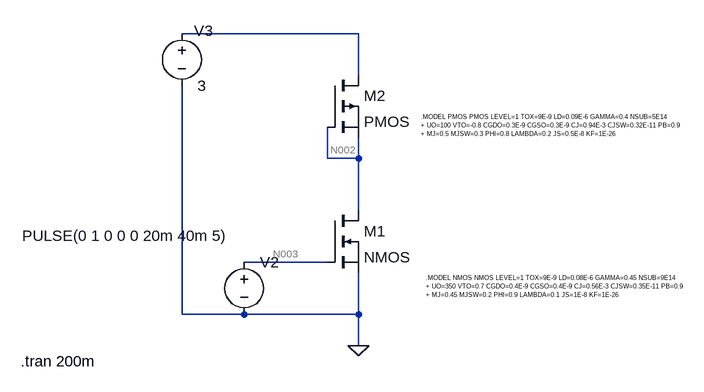
[diagram p0: schematic hw_1.asc]
hw_1.asc, the LTspice schematic file:
Version 4
SHEET 1 1112 680
WIRE 224 -128 -48 -128
WIRE 224 -64 224 -128
WIRE 176 64 176 16
WIRE 224 64 224 32
WIRE 224 64 176 64
WIRE 224 144 224 64
WIRE 176 224 48 224
WIRE -48 304 -48 -48
WIRE 48 304 -48 304
WIRE 224 304 224 240
WIRE 224 304 48 304
WIRE 224 352 224 304
FLAG 224 352 0
SYMBOL nmos 176 144 R0
SYMATTR InstName M1
SYMBOL pmos 176 -64 R0
SYMATTR InstName M2
SYMBOL voltage 48 208 R0
WINDOW 3 -342 -25 Left 2
WINDOW 123 0 0 Left 0
WINDOW 39 0 0 Left 0
SYMATTR InstName V2
SYMATTR Value PULSE(0 1 0 0 0 20m 40m 5)
SYMBOL voltage -48 -144 R0
WINDOW 0 19 12 Left 2
WINDOW 123 0 0 Left 0
WINDOW 39 0 0 Left 0
SYMATTR InstName V3
SYMATTR Value 3
TEXT 328 248 Left 0 !.MODEL NMOS NMOS LEVEL=1 TOX=9E-9 LD=0.08E-6 GAMMA=0.45 NSUB=9E14\n+ UO=350 VTO=0.7 CGDO=0.4E-9 CGSO=0.4E-9 CJ=0.56E-3 CJSW=0.35E-11 PB=0.9\n+ MJ=0.45 MJSW=0.2 PHI=0.9 LAMBDA=0.1 JS=1E-8 KF=1E-26
TEXT 320 0 Left 0 !.MODEL PMOS PMOS LEVEL=1 TOX=9E-9 LD=0.09E-6 GAMMA=0.4 NSUB=5E14\n+ UO=100 VTO=-0.8 CGDO=0.3E-9 CGSO=0.3E-9 CJ=0.94E-3 CJSW=0.32E-11 PB=0.9\n+ MJ=0.5 MJSW=0.3 PHI=0.8 LAMBDA=0.2 JS=0.5E-8 KF=1E-26
TEXT -296 376 Left 2 !.tran 200m

The netlist it stands for:
* hw_1.asc
M1 N002 N003 0 0 NMOS
M2 N001 N002 N002 N002 PMOS
V2 N003 0 PULSE(0 1 0 0 0 20m 40m 5)
V3 N001 0 3
.model NMOS NMOS
.model PMOS PMOS
.lib standard.mos
.MODEL NMOS NMOS LEVEL=1 TOX=9E-9 LD=0.08E-6 GAMMA=0.45 NSUB=9E14
+ UO=350 VTO=0.7 CGDO=0.4E-9 CGSO=0.4E-9 CJ=0.56E-3 CJSW=0.35E-11 PB=0.9
+ MJ=0.45 MJSW=0.2 PHI=0.9 LAMBDA=0.1 JS=1E-8 KF=1E-26
.MODEL PMOS PMOS LEVEL=1 TOX=9E-9 LD=0.09E-6 GAMMA=0.4 NSUB=5E14
+ UO=100 VTO=-0.8 CGDO=0.3E-9 CGSO=0.3E-9 CJ=0.94E-3 CJSW=0.32E-11 PB=0.9
+ MJ=0.5 MJSW=0.3 PHI=0.8 LAMBDA=0.2 JS=0.5E-8 KF=1E-26
.tran 200m
.backanno
.end

* Results of the author's LTspice run, read from the files saved beside the schematic
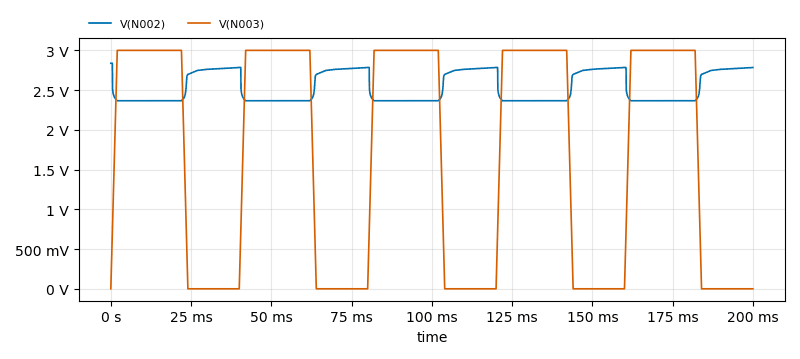
[diagram p1: Transient Analysis of hw_1.asc, plotted from the saved traces]
* Transient Analysis, 1 run:
*   V(N002): min 2.366 V, max 2.838 V, average 2.536 V, rms 2.544 V, last 2.784 V
*   V(N003): min 0 V, max 3 V, average 1.65 V, rms 2.191 V, last 0 V